# EAGLE schematic RS232_Adapter_ES_PCB (EAGLE 9.6.2)
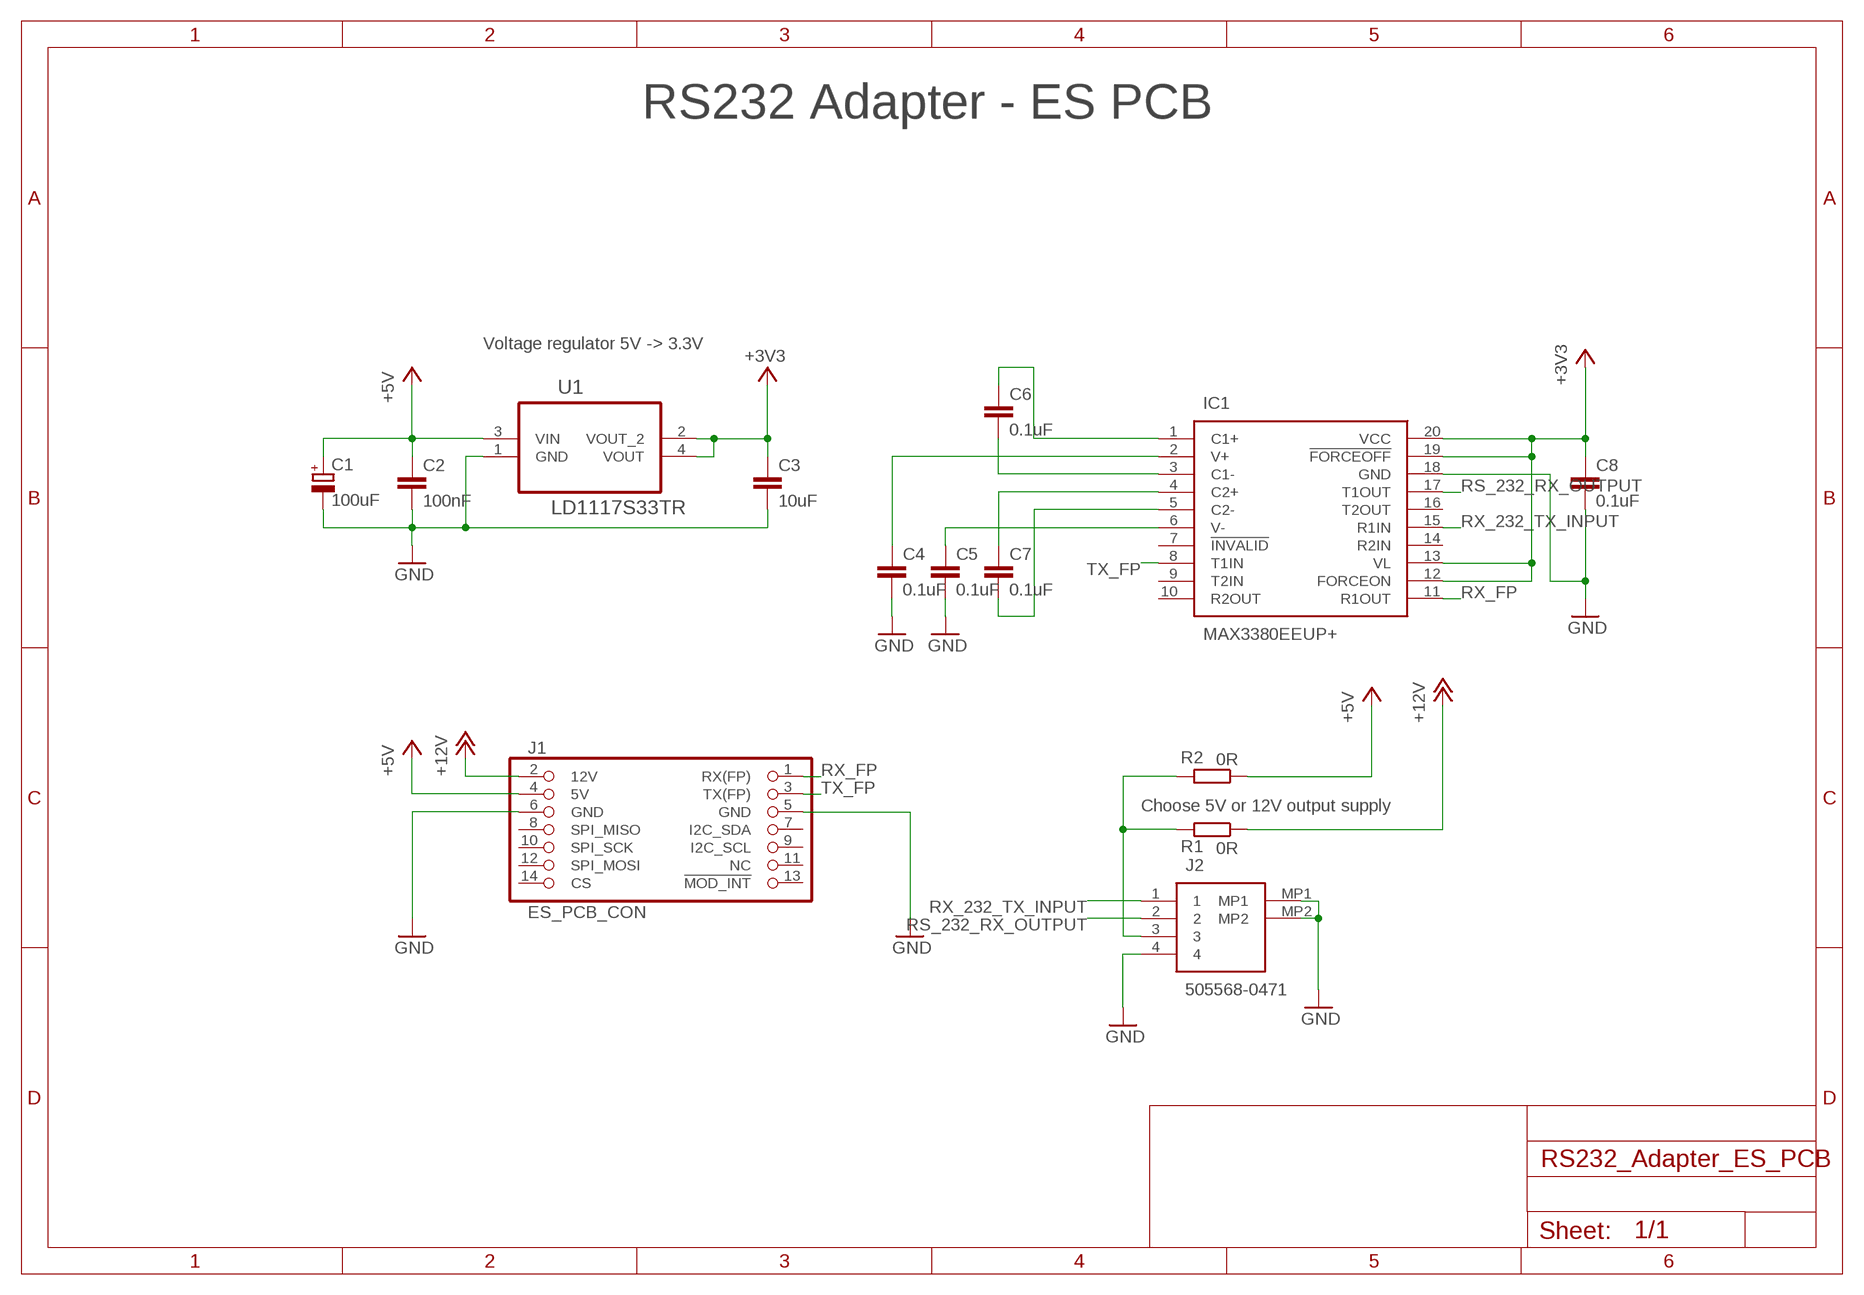
[diagram p0: schematic, sheet 1]

## Parts
C1  100uF  PANASONIC_C  [PANASONIC_C]
C2  100nF  C0603  [C0603]
C3  10uF  C0805  [C0805]
C4  0.1uF  C0603  [C0603]
C5  0.1uF  C0603  [C0603]
C6  0.1uF  C0603  [C0603]
C7  0.1uF  C0603  [C0603]
C8  0.1uF  C0603  [C0603]
IC1  MAX3380EEUP+  [SOP65P640X110-20N]
J1  ES_PCB_CON  [ES_PCB_CON]
J2  505568-0471  [5055680471]
R1  0R  R0603  [R0603]
R2  0R  R0603  [R0603]
U1  LD1117S33TR  [SOT230P700X180-4N]

## Nets
+3V3: C3.1 C8.1 IC1.12(FORCEON) IC1.13(VL) IC1.19(!FORCEOFF) IC1.20(VCC) U1.2(VOUT_2) U1.4(VOUT)
+5V: C1.+ C2.1 J1.4(5V) R2.1 U1.3(VIN)
+12V: J1.2(12V) R1.1
GND: C1.- C2.2 C3.2 C4.2 C5.2 C8.2 IC1.18(GND) J1.5(GND) J1.6(GND) J2.4 J2.MP1 J2.MP2 U1.1(GND)
N$1: J2.3 R1.2 R2.2
N$2: C4.1 IC1.2(V+)
N$3: C6.2 IC1.3(C1-)
N$4: C6.1 IC1.1(C1+)
N$5: C7.1 IC1.4(C2+)
N$6: C7.2 IC1.5(C2-)
N$7: C5.1 IC1.6(V-)
RS_232_RX_OUTPUT: IC1.17(T1OUT) J2.2
RX_232_TX_INPUT: IC1.15(R1IN) J2.1
RX_FP: IC1.11(R1OUT) J1.1(RX(FP))
TX_FP: IC1.8(T1IN) J1.3(TX(FP))
Unconnected: IC1.7(!INVALID) IC1.9(T2IN) IC1.10(R2OUT) IC1.14(R2IN) IC1.16(T2OUT) J1.7(I2C_SDA) J1.8(SPI_MISO) J1.9(I2C_SCL) J1.10(SPI_SCK) J1.11(NC) J1.12(SPI_MOSI) J1.13(!MOD_INT) J1.14(CS)

## Notes on the sheet
- RS232 Adapter - ES PCB
- Voltage regulator 5V -> 3.3V
- Choose 5V or 12V output supply

## Library data of the parts
C1 = CASE-RCL:PANASONIC_C: Panasonic VS Type Aluminum Electrolytic SMD Capacitors Size C - (TEAPO D5) Description: Size C of VS type SMD capacitor from Panasonic. Diameter of cap = 5mm. (TEAPO D5) Links: TEAPO1 <http://www.farnell.com/datasheets/2622415.pdf?_ga=2.91453018.1951585514.1537363662-1535130828.1530438260> TEAPO2 <http://www.teapo.com.tw/WebSiteFile/Products/Product_Data/EV%20%20SPEC.pdf> PANASONIC <https://industrial.panasonic.com/cdbs/www-data/pdf/RDE0000/DME0000COL92.pdf>
C2 C4-C8 = CASE-RCL:C0603: Standard Chip CAPACITOR 0605 (1608 Metric) Description: Standard Chip CAPACITOR 0605 (1608 Metric)
C3 = CASE-RCL:C0805: Standard Chip CAPACITOR 0805 (2012 Metric) Description: Standard Chip CAPACITOR 0805 (2012 Metric)
IC1 = RescueRunner:MAX3380EEUP+: Dual Transmitter/Receiver RS-232 Source: Datasheet <http://uk.rs-online.com/web/p/products/7329452P>; DESCRIPTION: Dual Transmitter/Receiver RS-232; HEIGHT: 1.1mm; MANUFACTURER_NAME: Maxim Integrated; MANUFACTURER_PART_NUMBER: MAX3380EEUP+; RS_PART_NUMBER: 7329452P; RS_PRICE-STOCK: http://uk.rs-online.com/web/p/products/7329452P
J1 = Unicorn_ACU_LIB:ES_PCB_CON
J2 = Unicorn_ACU_LIB:505568-0471: Horizontal
R1 R2 = CASE-RCL:R0603: Standard Chip RESISTOR 0603 (1608 Metric) Description: Standard Chip RESISTOR 0603 (1608 Metric)
U1 = CASE-Voltage_regulators:LD1117S33TR: LD1117S33TR, 3.3V LDO voltage regulator, SOT-223-4 Description: LD1117S33TR, 3.3V LDO voltage regulator in SOT-223-3 package - Input voltage: 4.75-15V - Output voltage: 3.3V - Output current: 800mA - Dropout voltage: 1.1V Links: Datasheet <http://www.farnell.com/datasheets/1776449.pdf?_ga=2.71508627.1869469127.1547838600-114062766.1547494298>; MPN: LD1117S33TR; OC_FARNELL: 2253484; OC_NEWARK: 89K0627; PACKAGE: SOT223-3; SUPPLIER: STMicroelectronics

## Net classes
0 default: width 0.3 mm